# EAGLE design PannelInterface (EAGLE 8.3.2)
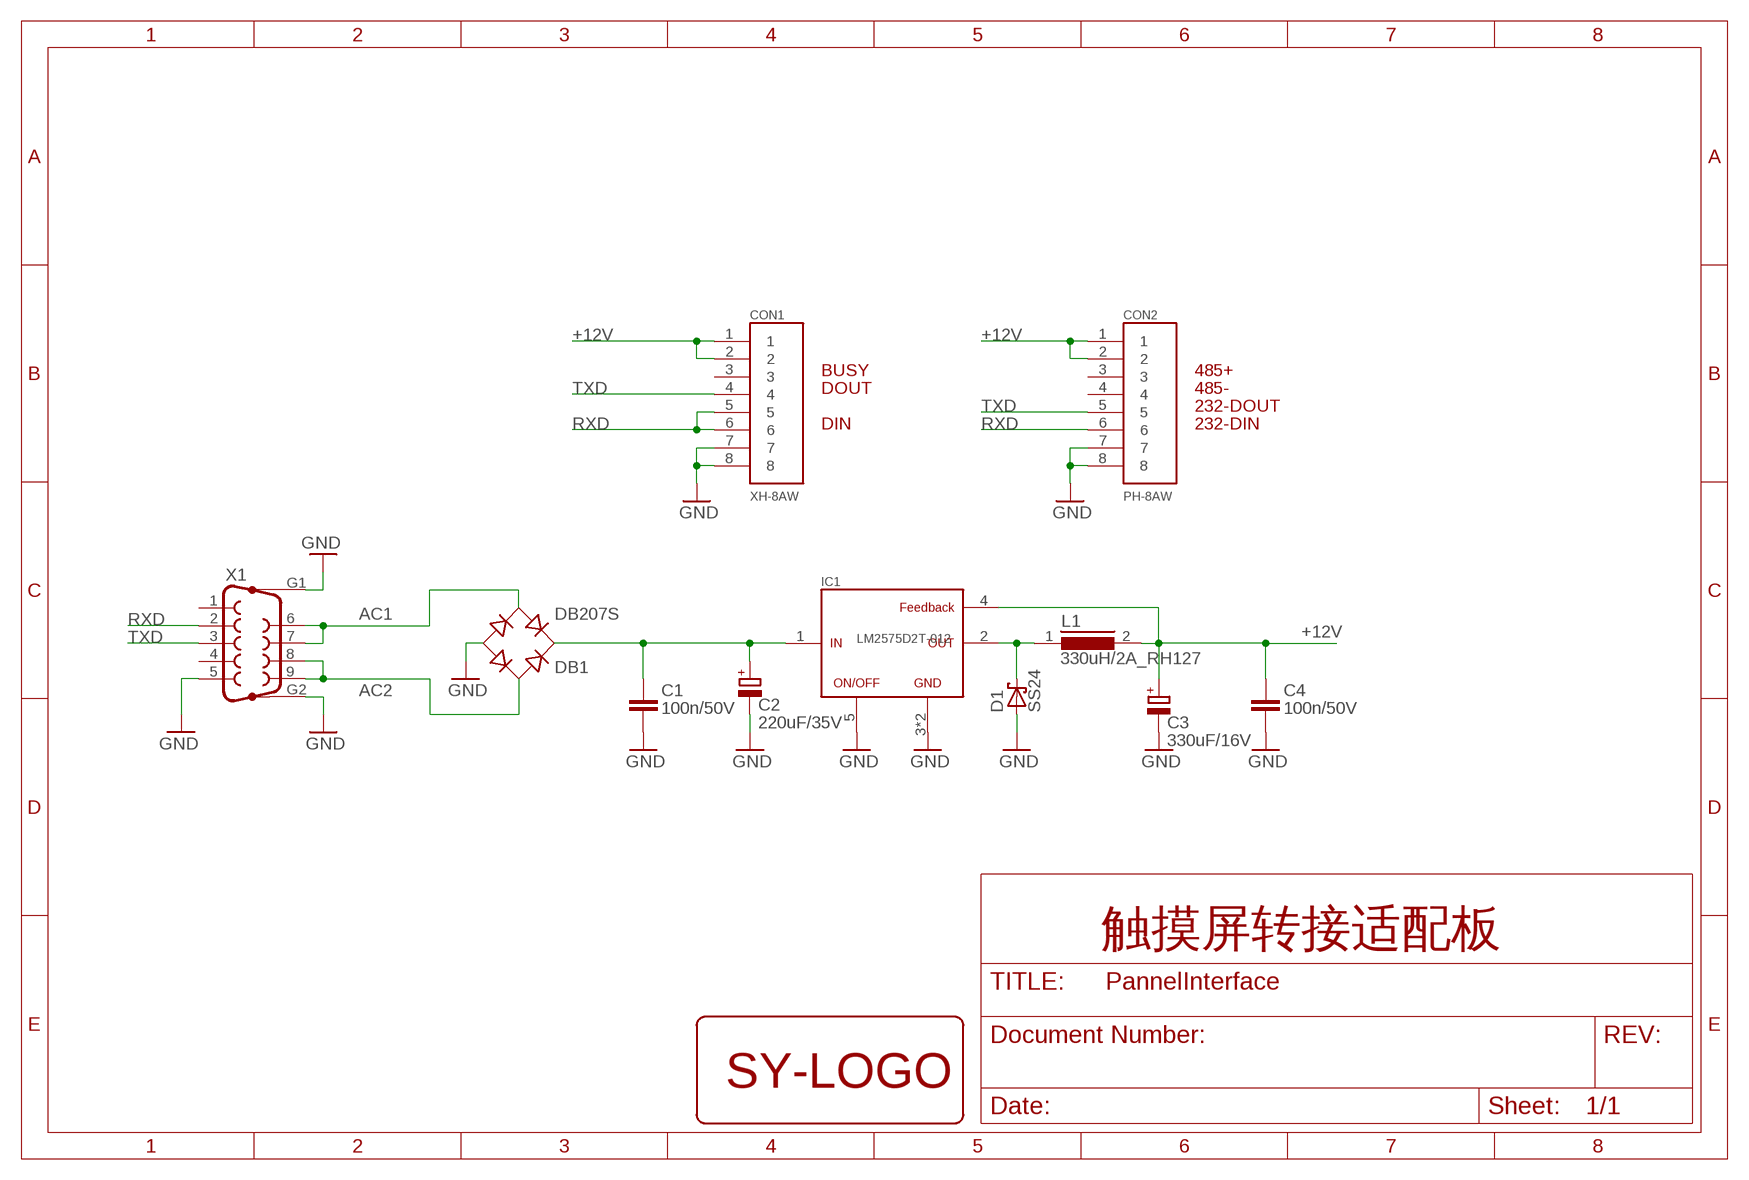
[diagram p0: schematic, sheet 1]

## Parts
C1  100n/50V  C0805  [C0805]
C2  220uF/35V  CPOL-EUTT5D11  [TT5D11]
C3  330uF/16V  CPOL-EUUD-8X10  [UD-8X10_NICHICON]
C4  100n/50V  C0805  [C0805]
CON1  XH-8AW  [XH-8AW]
CON2  PH-8AW  [PH-8AW]
D1  SS24  SCHOTTKY-DIODE-SS24  [DO214AA]
DB1  DB207S  [DBS]
IC1  LM2575D2T-012  LM2575D2T  [DDPAK-5_MICROCHIP]
L1  330uH/2A_RH127  POWER_INDUCTOR-1260  [MSS1260]
LOGO1  SY-LOGO_BOTTOM  [SY-LOGO_BOTTOM]
X1  F09HP  [F09HP]

## Nets
+12V: C3.+ C4.1 CON1.1 CON1.2 CON2.1 CON2.2 IC1.4 L1.2
AC1: DB1.AC2 X1.6 X1.7
AC2: DB1.AC1 X1.8 X1.9
GND: C1.2 C2.- C3.- C4.2 CON1.7 CON1.8 CON2.7 CON2.8 D1.A DB1.- IC1.3 IC1.5 IC1.6 X1.5 X1.G1 X1.G2
N$1: C1.1 C2.+ DB1.+ IC1.1
N$34: D1.C IC1.2 L1.1
RXD: CON1.5 CON1.6 CON2.6 X1.2
TXD: CON1.4 CON2.5 X1.3
Unconnected: CON1.3 CON2.3 CON2.4 X1.1 X1.4

## Notes on the sheet
- BUSY | 485+
- DOUT | 485-
- 232-DOUT
- DIN | 232-DIN
- 触摸屏转接适配板

## Library data of the parts
C1 C4 = SHMT:C
C2 C3 = rcl:CPOL-EU: POLARIZED CAPACITOR, European symbol
CON1 = prj-pannel_interface:XH-8AW
CON2 = prj-pannel_interface:PH-8AW: 90度，PH 插座，2.0mm间距 带座插头，侧装型，8P，JST 名称 S8B-PH-K-S
D1 = SHMT:SCHOTTKY-DIODE
DB1 = prj-pannel_interface:DB207S
IC1 = SHMT:LM2575: Pb−Free Add G at the end TO−220 (Vertical Mount) LM2575TV−ADJ LM2575TV−3.3 LM2575TV−005 LM2575TV−012 LM2575TV−015 TO−220 (Straight Lead) LM2575T−ADJ LM2575T−3.3 LM2575T−005 LM2575T−012 LM2575T−015 DDPAK-5, D2PAK (Surface Mount) LM2575D2T−ADJ LM2575D2T−3.3 LM2575D2T−005 LM2575D2T−012 LM2575D2T−015
L1 = SHMT:POWER_INDUCTOR
LOGO1 = LOGO:SY-LOGO
X1 = con-subd:F09HP: SUB-D; OC_FARNELL: unknown; OC_NEWARK: unknown

## Board
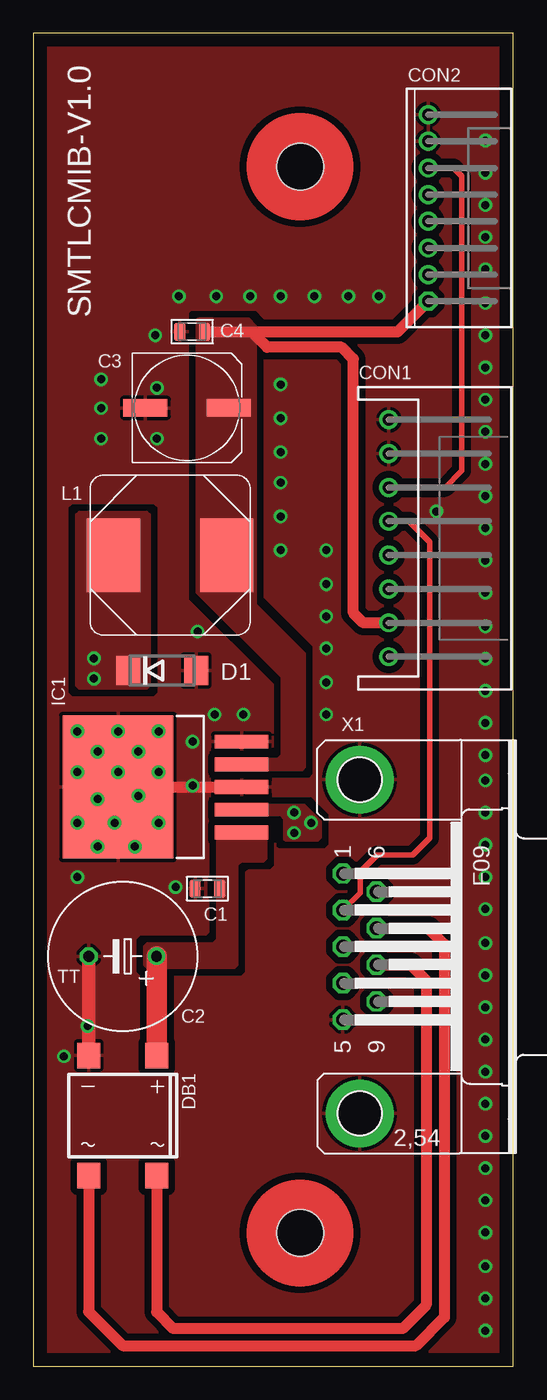
[diagram p1: board, top side]
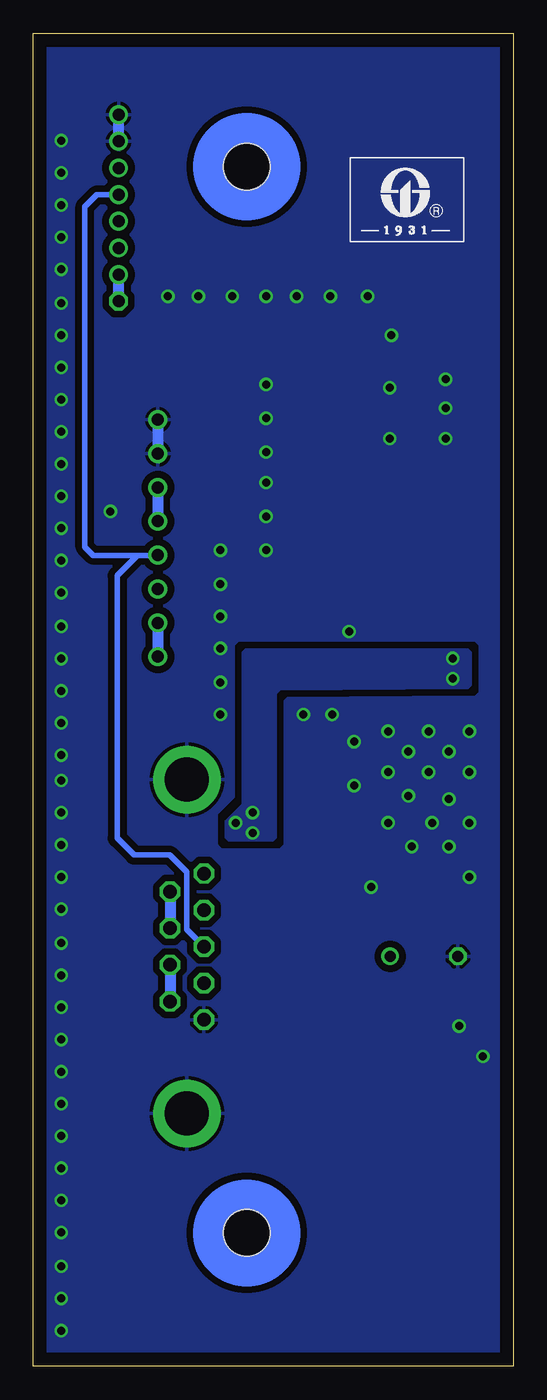
[diagram p2: board, bottom side, seen from below]

Size 36 x 100 mm. Coordinates in mm from the lower left corner, seen from the top.
Copper layers (1*16): Top 0.035mm / dielectric 1.5mm / Bottom 0.035mm
Design rules "default *": minimum track width 6mil, minimum drill 0.35mm, track to track 6mil, track to pad 6mil, pad to pad 6mil, via to via 6mil, smd to smd 6mil, copper to edge 40mil, drill to drill 6mil, minimum pad ring 10mil, minimum via ring 8mil, stop-mask expansion 4mil, vias tented up to drill 24mil, thermal gap 10mil

### Footprints (pad centres in the part's own frame; a part is rotated, then mirrored left to right if it is on the bottom)
C0805 = smd 0.85 x 1.35: 1 -0.925,0; 2 0.925,0
TT5D11 = drill 0.813: + -2.54,0 | drill 0.813 octagon: - 2.54,0
UD-8X10_NICHICON = smd 3.3 x 1.3: + 3.125,0; - -3.125,0
XH-8AW = drill 0.9: 1 0,0; 2 2.54,0; 3 5.08,0; 4 7.62,0; 5 10.16,0; 6 12.7,0; 7 15.24,0; 8 17.78,0
PH-8AW = drill 0.9 octagon: 1 0,0 | drill 0.9: 2 2,0; 3 4,0; 4 6,0; 5 8,0; 6 10,0; 7 12,0; 8 14,0
DO214AA = smd 1.8 x 2.2: A 2.55,0; C -2.55,0
DBS = smd 1.7 x 1.9: + -2.55,-4.5; - 2.55,-4.5; AC1 -2.55,4.5; AC2 2.55,4.5
DDPAK-5_MICROCHIP = smd 1.041 x 4.039: 1 -3.404,-5.105; 2 -1.702,-5.105; 3 0,-5.105; 4 1.702,-5.105; 5 3.404,-5.105 | smd 10.744 x 8.306: 6 0,4.153
MSS1260 = smd 5.5 x 4: 1 0,4.25; 2 0,-4.25
PANNEL-INTERFACE-OUTLINE = hole 3.5: 20,10; 20,90
F09HP = drill 1.016 octagon: 1 -5.486,-1.27; 2 -2.743,-1.27; 3 0,-1.27; 4 2.743,-1.27; 5 5.486,-1.27; 6 -4.115,1.27; 7 -1.372,1.27; 8 1.372,1.27; 9 4.115,1.27 | drill 3.302 pad 5.08: G1 -12.522,0; G2 12.522,0

### Placement (x,y rotation side)
C1  13.05,35.83 180 top
C2  6.7,30.75 180 top
C3  11.53,71.9 0 top
C4  11.91,77.61 180 top
CON1  26.66,53.23 90 top
CON2  29.61,79.9 90 top
D1  9.65,52.2 0 top
DB1  6.7,18.81 180 top
IC1  10.51,43.45 90 top
L1  10.26,60.85 90 top
LOGO1  7.97,87.9 0 top
U$1  [PANNEL-INTERFACE-OUTLINE]  0,0 0 top
X1  24.48,31.48 270 top

### Tracks (layer width: path | path; a pad name or v marks a point on that pad's centre or on a via)
+12V
  Top 0.813: 16.62,77.36 17.53,76.45 23.11,76.45 24,75.56 24,56.52 24.75,55.77 CON1.2 | C4.1 27.32,77.61 CON2.1
  Bottom 0.813: CON2.1 CON2.2 | CON1.2 CON1.1
  pour Top (no thermals): 13.72,44.7 20.19,44.7 20.45,44.96 20.45,53.47 16.76,57.15 16.76,78.03 16.18,78.61 12.32,78.61 12.19,78.49 12.19,58.04 18.54,51.69 18.54,45.85 18.29,45.59 13.72,45.59
AC1
  Top 0.813: DB1.AC2 4.15,4.09 6.7,1.54 28.72,1.54 30.83,3.65 30.83,31.65 29.63,32.85 X1.7
  Bottom 0.813: X1.6 X1.7
AC2
  Top 0.813: DB1.AC1 9.25,4.07 10.51,2.81 27.7,2.81 29.46,4.57 29.46,28.96 28.31,30.11 X1.8
  Bottom 0.813: X1.8 X1.9
GND  (via drill 0.6)
  Top 0.813: IC1.6 IC1.3 | 15.59,46.88 IC1.5
  Top 1.016: DB1.- C2.-
  Bottom 0.813: CON2.7 CON2.8 | CON1.8 CON1.7
  other vias: 3.3,47.62 13.59,48.9 15.75,48.9 11.94,46.86 4.83,46.1 6.35,47.62 7.87,46.1 9.4,47.62 3.3,44.58 6.35,44.58 9.4,44.58 4.83,42.55 7.87,42.8 3.3,40.77 6.1,40.77 9.4,40.77 7.62,38.99 4.83,38.99 11.94,43.56 10.67,35.94 2.29,23.24 4.06,25.53 3.3,36.7 12.32,55.12 5.08,71.88 9.27,73.41 9.27,69.6 5.08,74.04 5.08,69.6 18.54,71.12 18.54,73.66 18.54,68.58 18.54,63.75 18.54,66.29 18.54,61.21 16.26,80.26 13.72,80.26 18.54,80.26 23.62,80.26 21.08,80.26 25.91,80.26 33.91,48.26 33.91,45.85 33.91,50.67 33.91,55.5 33.91,53.09 33.91,58.04 9.14,77.34 21.97,58.67 21.97,61.21 21.97,56.26 21.97,51.31 21.97,53.85 21.97,48.9 10.92,80.26 33.91,82.3 33.91,79.76 33.91,84.71 33.91,89.53 33.91,87.12 33.91,91.95 33.91,67.69 33.91,65.28 33.91,70.1 33.91,74.93 33.91,72.52 33.91,77.34 33.91,60.45 33.91,62.87 30.23,64.14 33.91,2.67 33.91,7.49 33.91,5.08 33.91,10.03 33.91,34.29 33.91,31.75 33.91,36.7 33.91,41.53 33.91,39.12 33.91,43.94 33.91,19.68 33.91,17.27 33.91,22.1 33.91,26.92 33.91,24.51 33.91,29.34 33.91,12.45 33.91,14.86
  pour Bottom (isolate 0.508, rank 4): -1.52,-1.02 37.08,-1.02 37.08,101.6 -1.52,101.6
  pour Top (isolate 0.508, rank 4): -1.52,-1.78 37.85,-1.78 37.85,101.47 -1.52,101.47
N$1
  Top 1.524: C2.+ DB1.+
  pour Top (no thermals): 13.72,40.51 13.72,32 13.46,31.75 8.51,31.75 8.26,31.5 8.26,30.1 8.51,29.84 15.11,29.84 15.37,30.1 15.37,37.59 15.62,37.85 17.27,37.85 17.53,38.1 17.53,40.51
N$34  (via drill 0.6)
  other vias: 19.56,41.53 4.54,53.1 4.54,51.58 19.56,40.01 20.83,40.77
  pour Top (rank 3, no thermals): 8.51,50.8 3.43,50.8 3.17,51.05 3.17,63.88 3.43,64.14 8.51,64.14 8.76,63.88 8.76,51.05
  pour Bottom (no thermals): 3.17,53.59 3.17,51.05 3.43,50.8 17.53,50.68 17.78,50.42 17.78,39.63 18.04,39.38 21.34,39.36 21.59,39.62 21.59,40.89 20.32,42.16 20.32,53.59 20.07,53.85 3.43,53.85
  pour Top (no thermals): 13.72,42.16 20.32,42.16 21.59,40.89 21.59,39.62 21.34,39.37 18.92,39.37 18.8,39.5 18.8,41.02 18.54,41.27 13.72,41.27
RXD
  Top 0.406: X1.2 24.51,35.52 24.51,37.08 25.78,38.35 28.45,38.35 29.72,39.62 29.72,61.85 28.19,63.37 26.68,63.37 CON1.5 | CON2.6 31.51,89.9 32.13,89.28 32.13,67.18 30.88,65.93 CON1.6
  Bottom 0.813: CON1.6 CON1.5
TXD
  Bottom 0.406: X1.3 24.51,32.78 24.51,37.08 25.78,38.35 28.45,38.35 29.72,39.62 29.72,59.31 28.19,60.83 | 28.19,60.83 26.68,60.83 CON1.4 | CON2.5 29.62,87.88 31.24,87.88 32.13,87 32.13,61.47 31.5,60.83 28.19,60.83

### Text on the board
tPlace: SMTLCMIB-V1.0